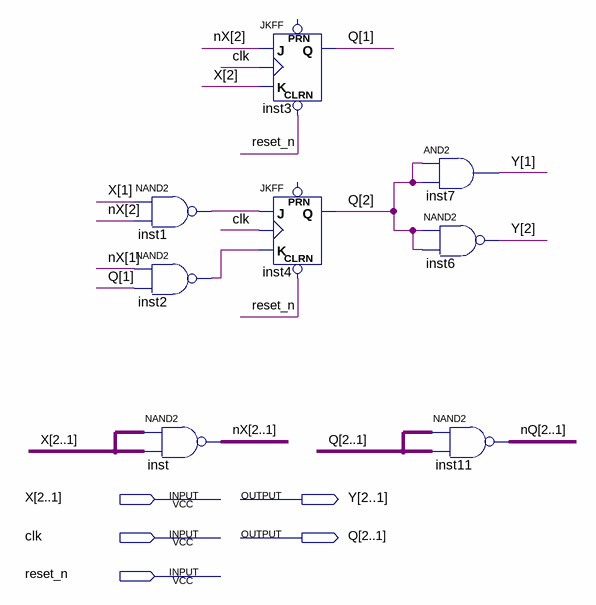
[diagram p0: schematic sheet]
// Quartus schematic lab4.bdf as structural Verilog: 8 symbols, 5 pins
module lab4 (
  input  [2:1] X,
  input  clk,
  input  reset_n,
  output [2:1] Y,
  output [2:1] Q
);

  wire inst1_out, inst2_out;
  wire [2:1] nQ, nX;

  nand inst1 (inst1_out, X[1], nX[2]);
  nand inst2 (inst2_out, nX[1], Q[1]);
  assign nX = ~(X & X);  // NAND2 inst, 2 bits wide
  JKFF inst3 (.CLRN(reset_n), .K(X[2]), .J(nX[2]), .CLK(clk), .Q(Q[1]));  // open: PRN
  JKFF inst4 (.CLRN(reset_n), .K(inst2_out), .J(inst1_out), .CLK(clk), .Q(Q[2]));  // open: PRN
  and inst7 (Y[1], Q[2], Q[2]);
  nand inst6 (Y[2], Q[2], Q[2]);
  assign nQ = ~(Q & Q);  // NAND2 inst11, 2 bits wide
endmodule
